# Altium schematic sheet AFE_conn.SchDoc: AI ARTIQ Driver
size 420 x 297 mm; Author: G.Kasprowicz; CompanyName: CTI; Organization: CTI; Address1: CTI; Address2: Nowowiejska 15/19 00-665 Warsaw; Address3: gkasprow@gmail.com; DocumentNumber: 7; Revision: 1.0; SheetNumber: 7; SheetTotal: 11; ModifiedBy: -; CheckedDate: -; Title2: AFE con; DivGrp: CTI; ModifiedDate: -; ProjectName: Sensor Box
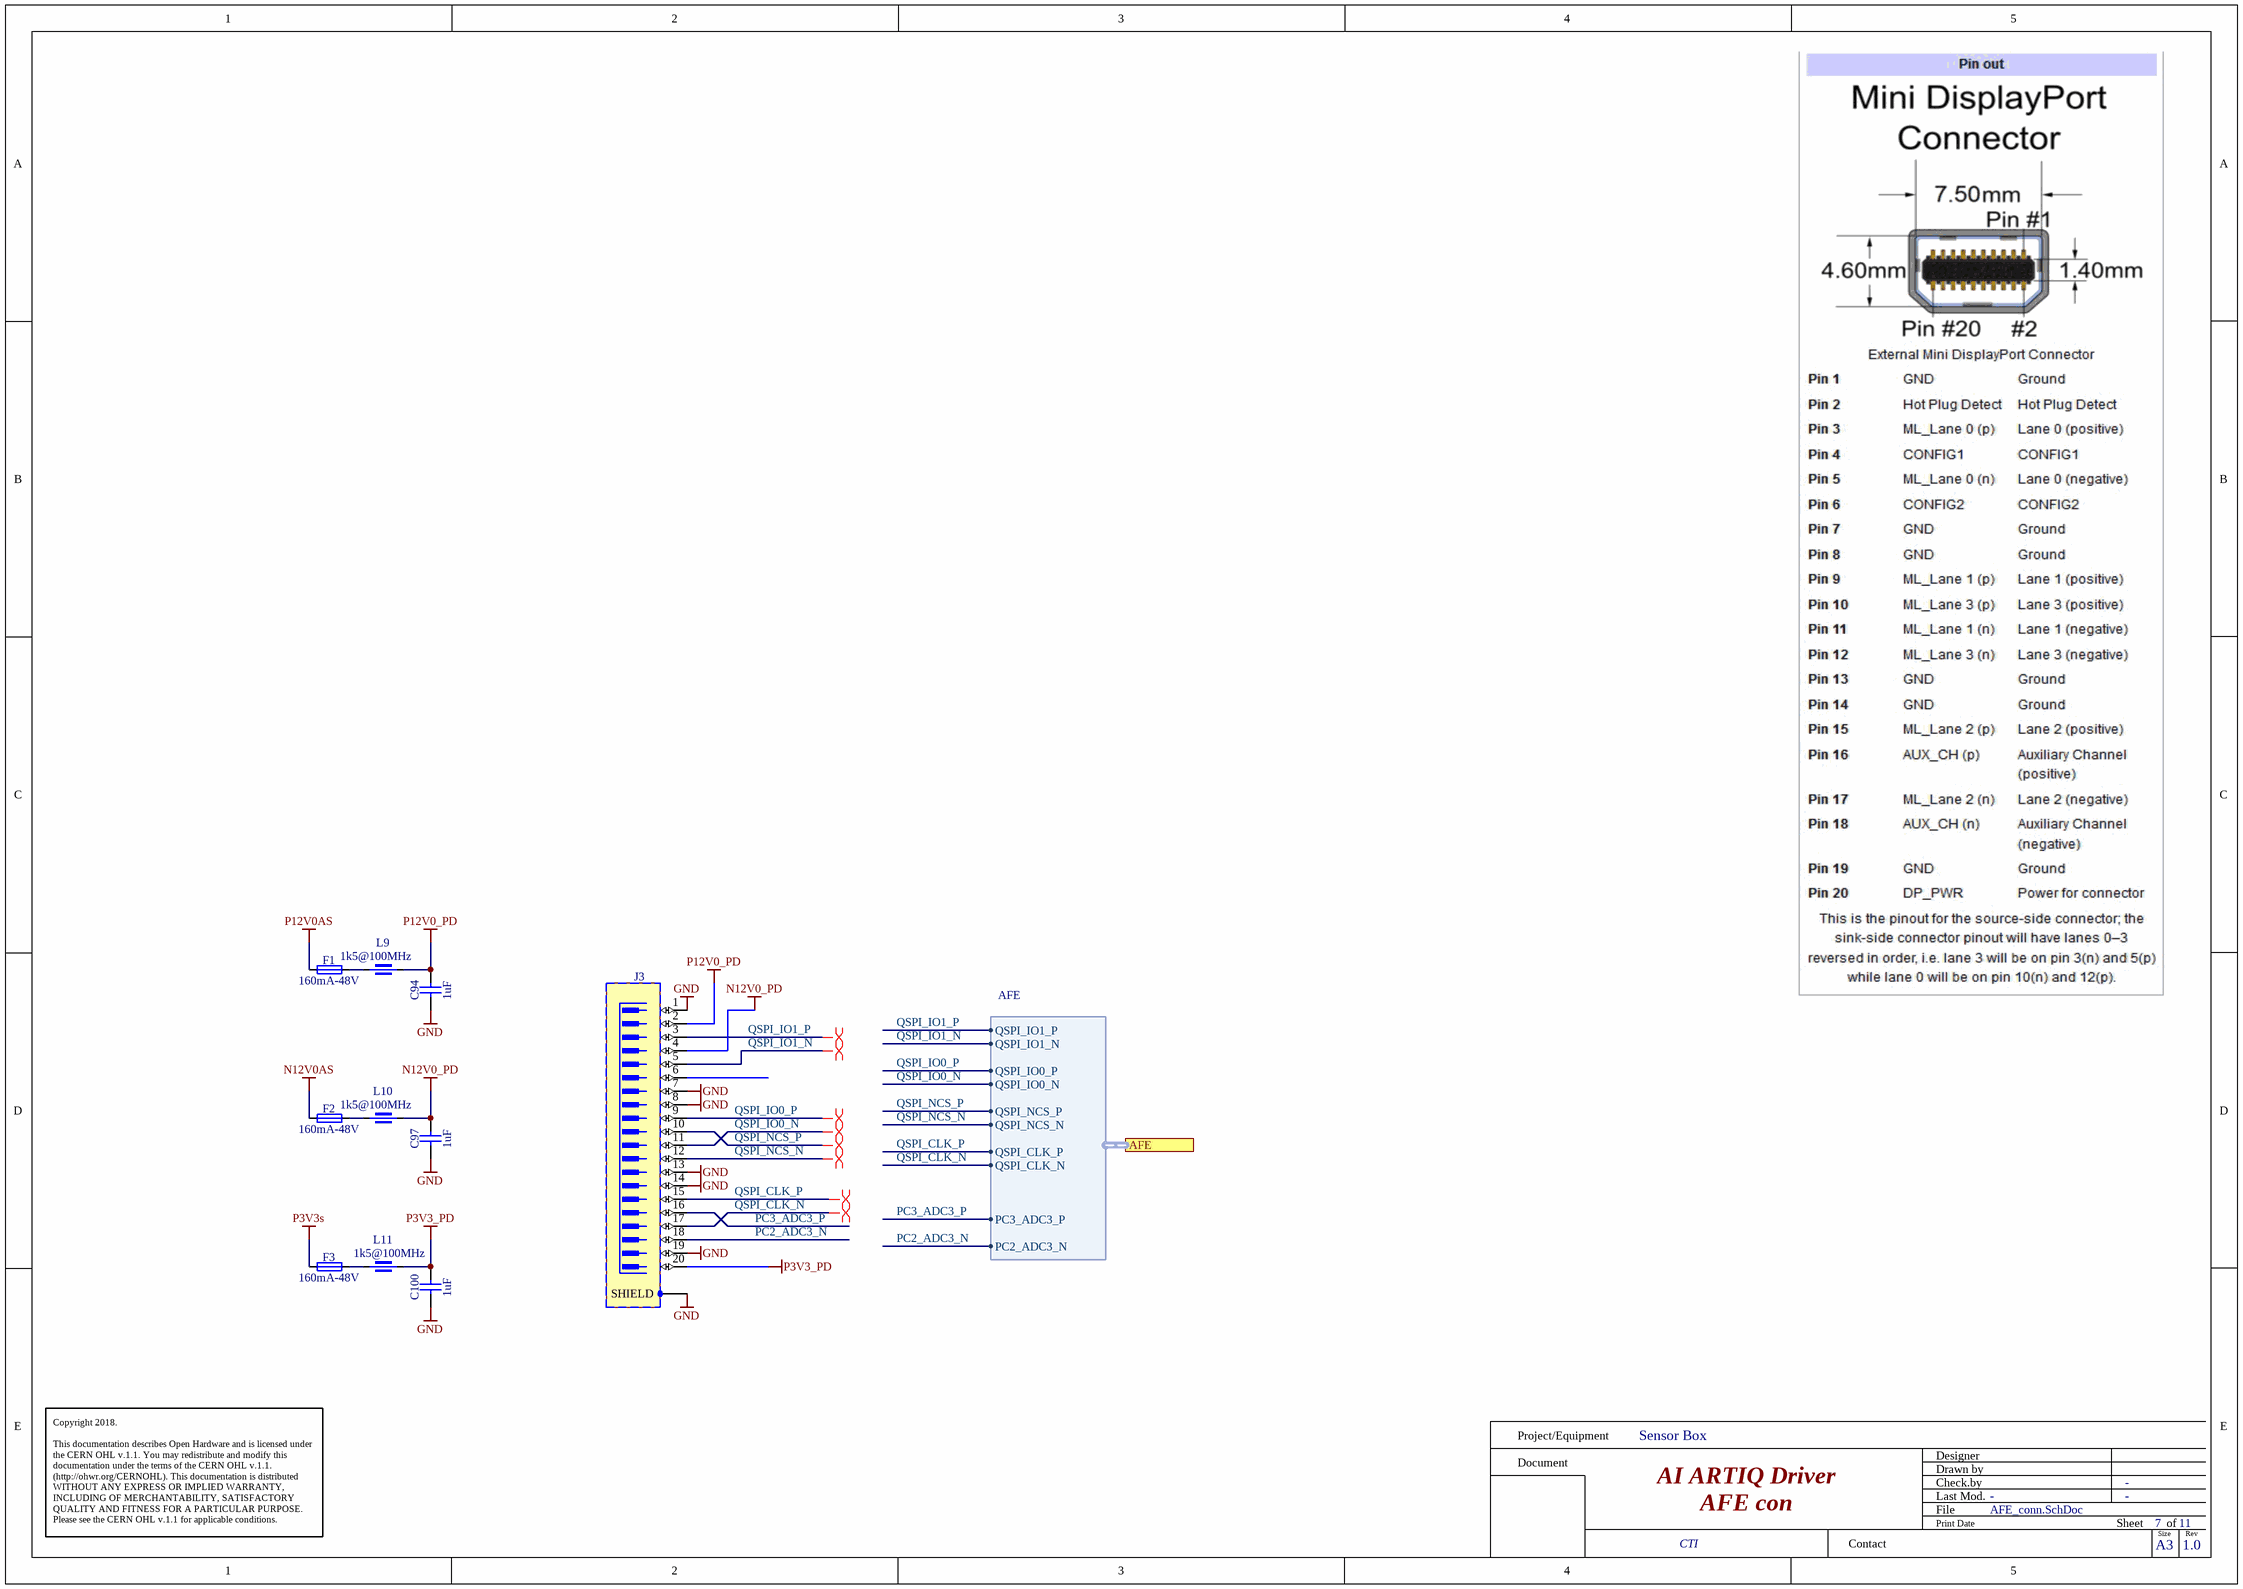
[diagram p0: AFE_conn.SchDoc]

## Parts
C94  1uF  [CAPC2012X135N]
C97  1uF  [CAPC2012X135N]
C100  1uF  [CAPC2012X135N]
F1  160mA-48V  [FUSRC3216X100N]
F2  160mA-48V  [FUSRC3216X100N]
F3  160mA-48V  [FUSRC3216X100N]
J3  Thunderbolt  [JAE_DP3AR020SU32JQ1R400]  (value not drawn)
L9  1k5@100MHz  [INDC2012X110N]
L10  1k5@100MHz  [INDC2012X110N]
L11  1k5@100MHz  [INDC2012X110N]

## Ports
AFE (harness AFE)

## Harnesses
AFE: QSPI_IO1_P, QSPI_IO1_N, QSPI_IO0_P, QSPI_IO0_N, QSPI_NCS_P, QSPI_NCS_N, QSPI_CLK_P, QSPI_CLK_N, PC3_ADC3_P, PC2_ADC3_N

## Nets
GND: C94.1 C97.1 C100.1 J3.1 J3.7 J3.8 J3.13 J3.14 J3.19 J3.SHIELD
N12V0_PD: C97.2 J3.4 L10.2
N12V0AS: F2.1
P3V3_PD: C100.2 J3.20 L11.2
P3V3s: F3.1
P12V0_PD: C94.2 J3.2 L9.2
P12V0AS: F1.1
PC2_ADC3_N: J3.18 ; port AFE.PC2_ADC3_N
PC3_ADC3_P: J3.16 ; port AFE.PC3_ADC3_P
QSPI_CLK_N: J3.17 ; port AFE.QSPI_CLK_N
QSPI_CLK_P: J3.15 ; port AFE.QSPI_CLK_P
QSPI_IO0_N: J3.11 ; port AFE.QSPI_IO0_N
QSPI_IO0_P: J3.9 ; port AFE.QSPI_IO0_P
QSPI_IO1_N: J3.5 ; port AFE.QSPI_IO1_N
QSPI_IO1_P: J3.3 ; port AFE.QSPI_IO1_P
QSPI_NCS_N: J3.12 ; port AFE.QSPI_NCS_N
QSPI_NCS_P: J3.10 ; port AFE.QSPI_NCS_P
NetF1_2: F1.2 L9.1
NetF2_2: F2.2 L10.1
NetF3_2: F3.2 L11.1

Not connected (* = marked no-connect by the designer): J3 6

## Layout directives
differential pair: QSPI_CLK_N, QSPI_CLK_P, QSPI_IO0_N, QSPI_IO0_P, QSPI_IO1_N, QSPI_IO1_P, QSPI_NCS_N, QSPI_NCS_P

## Notes on the sheet
- Project/Equipment
- Document
- Designer
- Drawn by
- Check.by
- Copyright 2018.
  This documentation describes Open Hardware and is licensed under the CERN OHL v.1.1. You may redistribute and modify this documentation under the terms of the CERN OHL v.1.1. (http://ohwr.org/CERNOHL). This documentation is distributed WITHOUT ANY EXPRESS OR IMPLIED WARRANTY, INCLUDING OF MERCHANTABILITY, SATISFACTORY QUALITY AND FITNESS FOR A PARTICULAR PURPOSE. Please see the CERN OHL v.1.1 for applicable conditions.
- Contact
- File
- Last Mod.
- Print Date
- Sheet
- Size
- A3
- of
- Rev

## Library data of the parts
C94 C97 C100 = CC0805_1UF_16V_10%_X7R: Non-polarised capacitor; Part Description: SMD Multilayer Chip Ceramic Capacitor; Manufacturer: GENERIC; Manufacturer1 Part Number: C2012X7R1C105K125AA; Voltage: 16V; TC: X7R; Tolerance: ±10%; Part Number: CC0805_1UF_16V_10%_X7R; Component Kind: Standard; Component Type: Standard; Pin Count: 2; Value: 1uF; Status: Preferred; Manufacturer Part Number: CC0805_1UF_16V_10%_X7R; Case: 0805; Mounted: Yes; Socket: No; SMD: Yes; Sense: No; Manufacturer1 Example: TDK; Manufacturer1 ComponentHeight: 1.45mm; HelpURL: \\cern.ch\dfs\Applications\Altium\Datasheets\CC0805_X7R_TDK_C.pdf; Author: CERN DEM JLC; CreateDate: 03.12.2007; LatestRevisionDate: 22.04.2015
F1-F3 = FUSR1206_LITTELFUSE_NANOSMDC016F: Fuse; Part Description: PolySwitch® Resettable PPTC Overcurrent Protection Device; PressFit: No; Part Number: FUSR1206_LITTELFUSE_NANOSMDC016F; Component Kind: Standard; Component Type: Standard; Pin Count: 2; PackageDescription: Chip Resettable Fuse, 2-Leads, Body 3.2mmx1.6mm, IPC Medium Density; Family: Fuses Resettable; Mounted: Yes; Socket: No; SMD: Yes; Sense: No; Value: 160mA-48V; Manufacturer: LITTELFUSE; Manufacturer Part Number: nanoSMDC016F; ComponentHeight: 1mm; HelpURL: \\cern.ch\dfs\Applications\Altium\Datasheets\FUSR_LITTELFUSE_NanoSMDC.pdf; Author: CERN DEM BC; CreateDate: 25.02.2020; LatestRevisionDate: 25.02.2020
J3 = JAE_DP3AR020SU32JQ1R400: Connector Mini DisplayPort 20 Male + 1 Shield; Part Description: 20 Positions, 0.6mm Pitch, ThunderboltTM Technology Compatible Right Angled Connector; Manufacturer: JAE (JAPAN AVIATION ELECTRONICS INDUSTRY); PressFit: No; Part Number: JAE_DP3AR020SU32JQ1R400; Component Kind: Standard; Component Type: Standard; Pin Count: 21; Family: Thunderbolt; Mounted: Yes; Socket: No; SMD: Yes; Sense: No; Status: None; Manufacturer Part Number: DP3AR020SU32JQ1R400; ComponentHeight: 6.1mm; HelpURL: \\cern.ch\dfs\Applications\Altium\Datasheets\JAE_DP3AR020SU32JQ1R400.pdf; ComponentLink1URL: \\cern.ch\dfs\Applications\Altium\Datasheets\JAE_DP3_Catalog.pdf; ComponentLink1Description: DP3 Series Catalog; Author: CERN DEM JLC; CreateDate: 25.02.2015; LatestRevisionDate: 25.02.2015
L9-L11 = IND0805_WURTH_742792097: Part Description: SMD EMI Suppression Chip Ferrite Bead (WE-CBF Series); Manufacturer: WURTH ELEKTRONIK; Power: 1A; Resistance: 0.3R; Tolerance: ±25%; Part Number: IND0805_WURTH_742792097; Component Kind: Standard; Component Type: Standard; Pin Count: 2; Value: 1k5@100MHz; Manufacturer Part Number: 742792097; Case: 0805; Mounted: Yes; Socket: No; SMD: Yes; Sense: No; ComponentHeight: 1.1mm; HelpURL: \\cern.ch\dfs\Applications\Altium\Datasheets\IND0805_WURTH_742792097.pdf; Author: CERN DEM MR; CreateDate: 29.06.2017; LatestRevisionDate: 25.10.2018